# EAGLE design untitled (EAGLE 6.1)
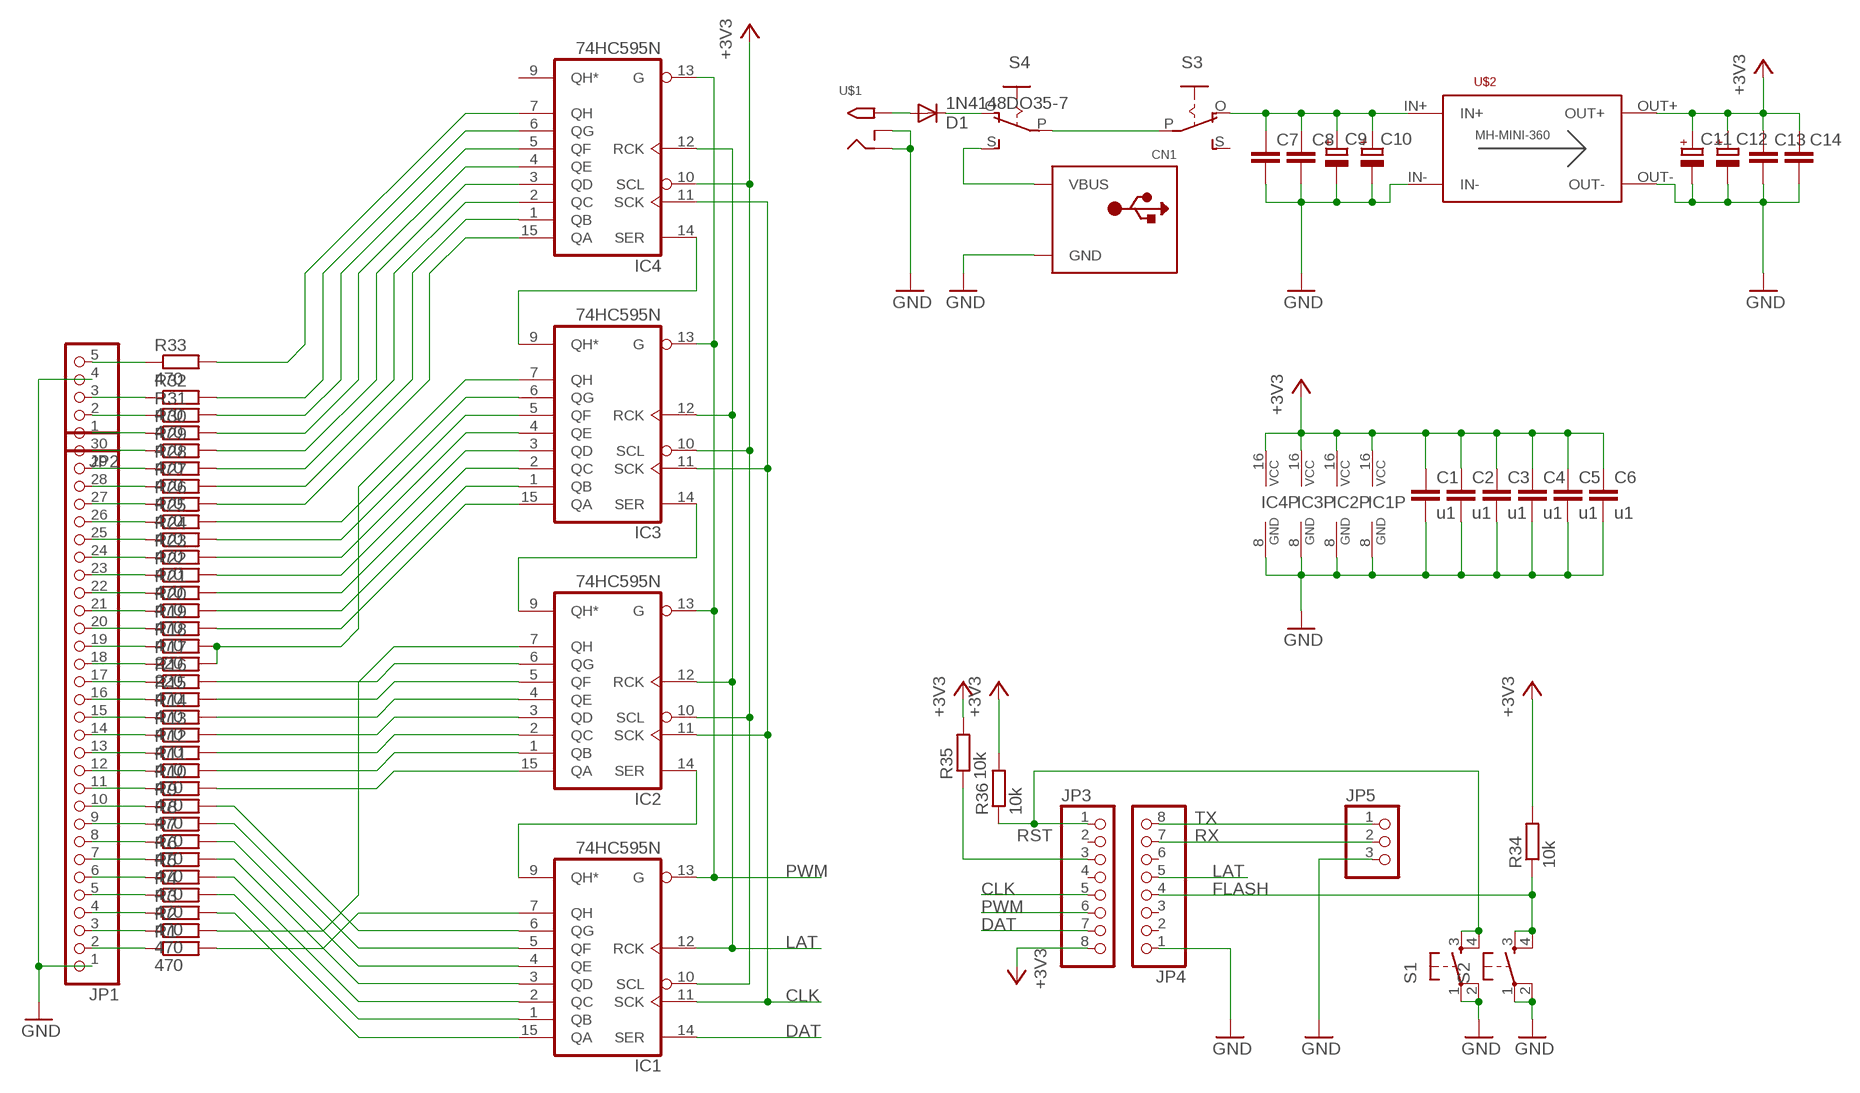
[diagram p0: schematic, sheet 1]

## Parts
C1  u1  C-EU025-025X050  [C025-025X050]
C2  u1  C-EU025-025X050  [C025-025X050]
C3  u1  C-EU025-025X050  [C025-025X050]
C4  u1  C-EU025-025X050  [C025-025X050]
C5  u1  C-EU025-025X050  [C025-025X050]
C6  u1  C-EU025-025X050  [C025-025X050]
C7  C-EU025-025X050  [C025-025X050]
C8  C-EU025-025X050  [C025-025X050]
C9  CPOL-EUE2.5-7  [E2,5-7]
C10  CPOL-EUE2.5-7  [E2,5-7]
C11  CPOL-EUE2.5-7  [E2,5-7]
C12  CPOL-EUE2.5-7  [E2,5-7]
C13  C-EU025-025X050  [C025-025X050]
C14  C-EU025-025X050  [C025-025X050]
CN1  USBPWR-ONLY  [USB-MINIB-THM]
D1  1N4148DO35-7  [DO35-7]
IC1  74HC595N  [DIL16]
IC2  74HC595N  [DIL16]
IC3  74HC595N  [DIL16]
IC4  74HC595N  [DIL16]
JP1  PINHD-1X30  [1X30]
JP2  PINHD-1X5  [1X05]
JP3  PINHD-1X8  [1X08]
JP4  PINHD-1X8  [1X08]
JP5  PINHD-1X3  [1X03]
R1  470  R-EU_0204/5  [0204/5]
R2  470  R-EU_0204/5  [0204/5]
R3  470  R-EU_0204/5  [0204/5]
R4  470  R-EU_0204/5  [0204/5]
R5  470  R-EU_0204/5  [0204/5]
R6  470  R-EU_0204/5  [0204/5]
R7  470  R-EU_0204/5  [0204/5]
R8  470  R-EU_0204/5  [0204/5]
R9  470  R-EU_0204/5  [0204/5]
R10  470  R-EU_0204/5  [0204/5]
R11  470  R-EU_0204/5  [0204/5]
R12  470  R-EU_0204/5  [0204/5]
R13  470  R-EU_0204/5  [0204/5]
R14  470  R-EU_0204/5  [0204/5]
R15  470  R-EU_0204/5  [0204/5]
R16  470  R-EU_0204/5  [0204/5]
R17  220  R-EU_0204/5  [0204/5]
R18  220  R-EU_0204/5  [0204/5]
R19  470  R-EU_0204/5  [0204/5]
R20  470  R-EU_0204/5  [0204/5]
R21  470  R-EU_0204/5  [0204/5]
R22  470  R-EU_0204/5  [0204/5]
R23  470  R-EU_0204/5  [0204/5]
R24  470  R-EU_0204/5  [0204/5]
R25  470  R-EU_0204/5  [0204/5]
R26  470  R-EU_0204/5  [0204/5]
R27  470  R-EU_0204/5  [0204/5]
R28  470  R-EU_0204/5  [0204/5]
R29  470  R-EU_0204/5  [0204/5]
R30  470  R-EU_0204/5  [0204/5]
R31  470  R-EU_0204/5  [0204/5]
R32  470  R-EU_0204/5  [0204/5]
R33  470  R-EU_0204/5  [0204/5]
R34  10k  R-EU_0204/7  [0204/7]
R35  10k  R-EU_0207/10  [0207/10]
R36  10k  R-EU_0207/10  [0207/10]
S1  TAC_SWITCHPTH  [TACTILE-PTH]
S2  TAC_SWITCHPTH  [TACTILE-PTH]
S3  EG1218S  [EG1218]
S4  EG1218S  [EG1218]
U$1  2.1MMJACKTHM  [PJ-102A]
U$2  DC-DC_CONV_MINISTD  [DC-DC_CONV_MINI]

## Nets
+3V3: C1.1 C2.1 C3.1 C4.1 C5.1 C6.1 C11.+ C12.+ C13.1 C14.1 IC1.10(SCL) IC1.16(VCC) IC2.10(SCL) IC2.16(VCC) IC3.10(SCL) IC3.16(VCC) IC4.10(SCL) IC4.16(VCC) JP3.8 R34.2 R35.2 R36.2 U$2.OUT+
CLK: IC1.11(SCK) IC2.11(SCK) IC3.11(SCK) IC4.11(SCK) JP3.5
DAT: IC1.14(SER) JP3.7
FLASH: JP4.4 R34.1 S2.3 S2.4
GND: C1.2 C2.2 C3.2 C4.2 C5.2 C6.2 C7.2 C8.2 C9.- C10.- C11.- C12.- C13.2 C14.2 CN1.GND CN1.GND1(GND) CN1.GND2(GND) CN1.GND3(GND) CN1.GND4(GND) IC1.8(GND) IC2.8(GND) IC3.8(GND) IC4.8(GND) JP1.1 JP2.4 JP4.1 JP5.3 S1.1 S1.2 S2.1 S2.2 U$1.RING U$1.RING_SW U$2.IN- U$2.OUT-
LAT: IC1.12(RCK) IC2.12(RCK) IC3.12(RCK) IC4.12(RCK) JP4.5
N$1: JP1.3 R2.1
N$2: JP1.2 R1.1
N$3: JP1.4 R3.1
N$4: JP1.5 R4.1
N$5: JP1.6 R5.1
N$6: JP1.7 R6.1
N$7: JP1.8 R7.1
N$8: JP1.9 R8.1
N$9: JP1.10 R9.1
N$10: JP1.11 R10.1
N$11: JP1.12 R11.1
N$12: JP1.13 R12.1
N$13: JP1.14 R13.1
N$14: JP1.15 R14.1
N$15: JP1.16 R15.1
N$16: JP1.17 R16.1
N$17: JP1.18 R17.1
N$18: JP1.19 R18.1
N$19: JP1.20 R19.1
N$20: JP1.21 R20.1
N$21: JP1.22 R21.1
N$22: JP1.23 R22.1
N$23: JP1.24 R23.1
N$24: JP1.25 R24.1
N$25: JP1.26 R25.1
N$26: JP1.27 R26.1
N$27: JP1.28 R27.1
N$28: JP1.29 R28.1
N$29: IC4.15(QA) R26.2
N$30: IC1.9(QH*) IC2.14(SER)
N$31: IC2.9(QH*) IC3.14(SER)
N$32: IC3.9(QH*) IC4.14(SER)
N$33: IC1.7(QH) R1.2
N$34: IC1.15(QA) R3.2
N$35: IC1.1(QB) R4.2
N$36: IC1.2(QC) R5.2
N$37: IC1.3(QD) R6.2
N$38: IC1.4(QE) R7.2
N$39: IC1.5(QF) R8.2
N$40: IC1.6(QG) R9.2
N$41: IC2.7(QH) R2.2
N$42: IC2.15(QA) R10.2
N$43: IC2.1(QB) R11.2
N$44: IC2.2(QC) R12.2
N$45: IC2.3(QD) R13.2
N$46: IC2.4(QE) R14.2
N$47: IC2.5(QF) R15.2
N$48: IC2.6(QG) R16.2
N$49: IC4.1(QB) R27.2
N$50: IC3.15(QA) R19.2
N$51: IC3.1(QB) R20.2
N$52: IC3.2(QC) R21.2
N$53: IC3.3(QD) R22.2
N$54: IC3.4(QE) R23.2
N$55: IC3.5(QF) R24.2
N$56: IC3.6(QG) R25.2
N$57: JP1.30 R29.1
N$58: JP2.1 R30.1
N$59: JP2.2 R31.1
N$60: JP2.3 R32.1
N$61: JP2.5 R33.1
N$62: IC3.7(QH) R17.2 R18.2
N$63: IC4.2(QC) R28.2
N$64: IC4.3(QD) R29.2
N$65: IC4.4(QE) R30.2
N$66: IC4.5(QF) R31.2
N$67: IC4.6(QG) R32.2
N$68: IC4.7(QH) R33.2
N$69: JP3.3 R35.1
N$70: D1.A U$1.TIP
N$72: C7.1 C8.1 C9.+ C10.+ S3.O U$2.IN+
N$73: S3.P S4.P
N$74: CN1.VBUS S4.S
N$75: D1.C S4.O
PWM: IC1.13(G) IC2.13(G) IC3.13(G) IC4.13(G) JP3.6
RST: JP3.1 R36.1 S1.3 S1.4
RX: JP4.7 JP5.2
TX: JP4.8 JP5.1
Unconnected: IC4.9(QH*) JP3.2 JP3.4 JP4.2 JP4.3 JP4.6 S3.S

## Library data of the parts
C1-C8 C13 C14 = rcl:C-EU: CAPACITOR, European symbol
C9-C12 = rcl:CPOL-EU: POLARIZED CAPACITOR, European symbol
CN1 = _MY_OWN_LIB:USB: USB Connectors USBMINIB - Surface Mount Female Mini-B USB Connector 4UConnector: 06564 By microbuilder.eu Thru-hole RA Female Mini-B USB Connector 4UConnector: 18732 By ladyada.net
D1 = diode:1N4148: DIODE high speed (Philips)
IC1-IC4 = 74xx-eu:74*595: 8-bit SHIFT REGISTER, output latch
JP1 = pinhead:PINHD-1X30: PIN HEADER
JP2 = pinhead:PINHD-1X5: PIN HEADER
JP3 JP4 = pinhead:PINHD-1X8: PIN HEADER
JP5 = pinhead:PINHD-1X3: PIN HEADER
R1-R36 = rcl:R-EU_: RESISTOR, European symbol
S1 S2 = SparkFun-Electromechanical:TAC_SWITCH: Momentary Switch Button commonly used for reset or general input. Spark Fun Electronics SKU : COM-00097 SMT- SWCH-08247
S3 S4 = _MY_OWN_LIB:EG1218: SLIDING SWITCH 0.1" spacing through hole, vertical SPDT slide switch http://www.ladyada.net/library/pcb/eaglelibrary.html
U$1 = adafruit:2.1MMJACK: 2.1mm x 5.5mm THM DC jack with internal switch. Digikey part #PJ-102A, 4UCON part #05537 2.1mm x 5.5mm SMT DC jack with internal switch. Digikey part #PJ-002A-SMT, 4UCON part #03267 By microbuilder.eu & adafruit.com
U$2 = _MY_OWN_LIB:DC-DC_CONV_MINI

## Board
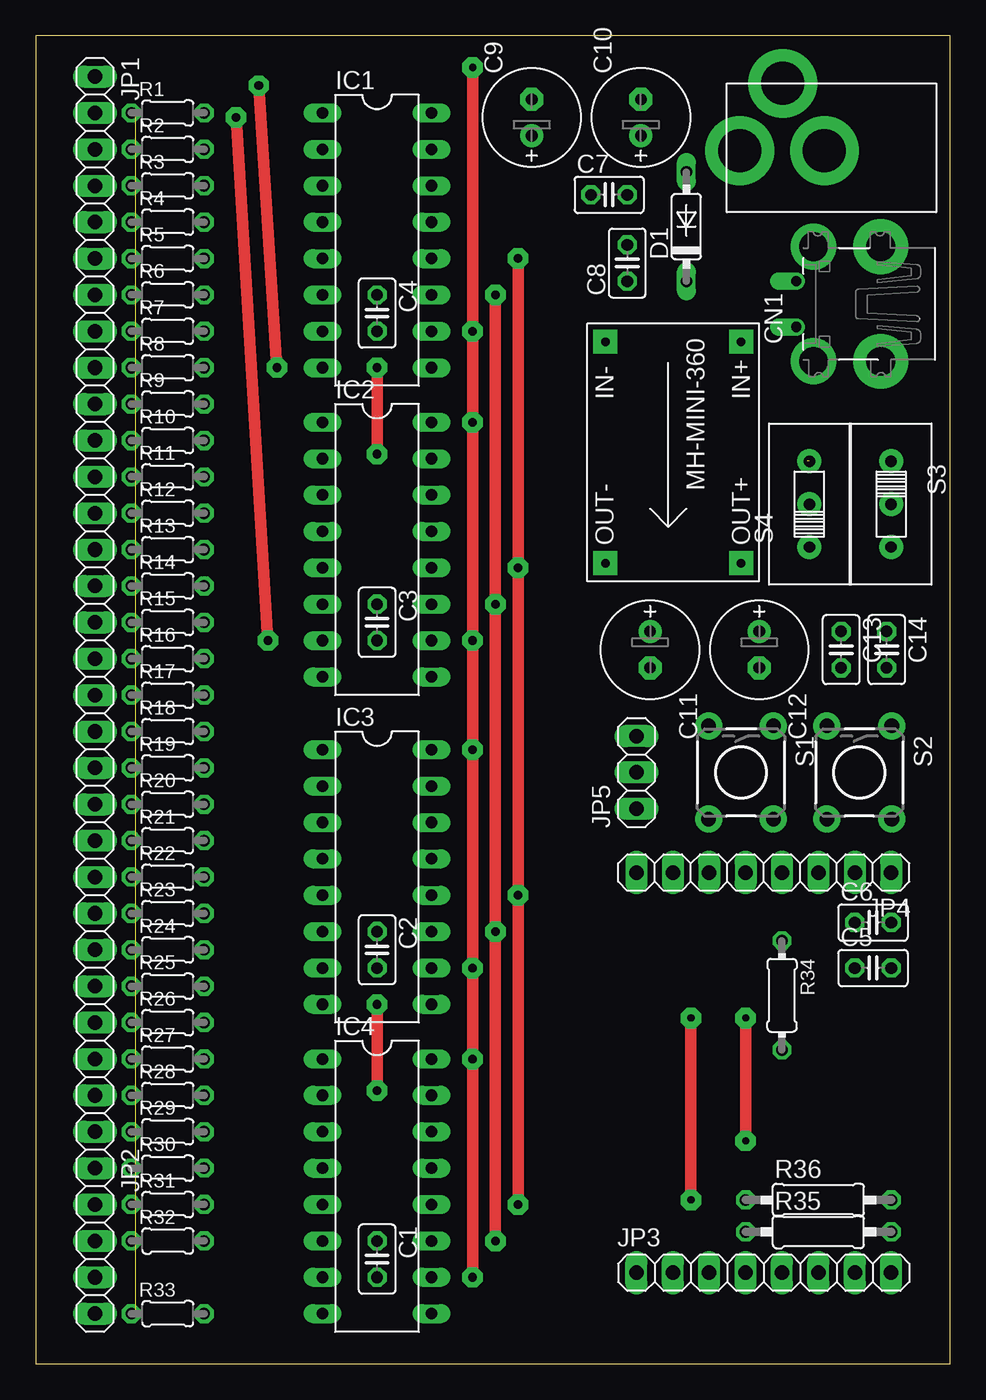
[diagram p1: board, top side]
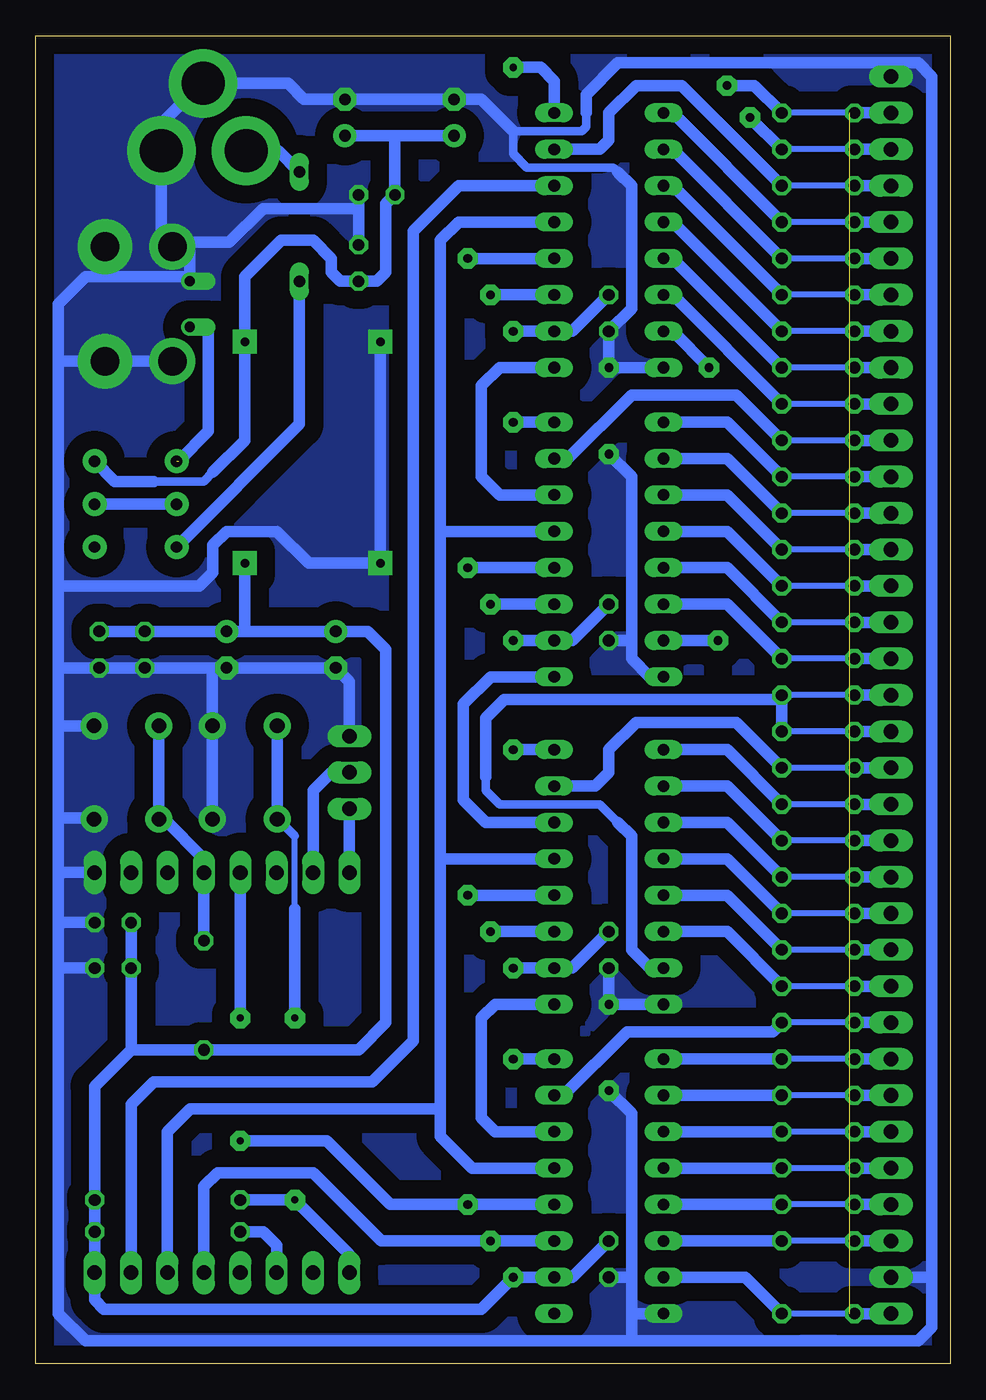
[diagram p2: board, bottom side, seen from below]

Size 63.8 x 92.7 mm. Coordinates in mm from the lower left corner, seen from the top.
Outline: 0,0 63.8,0 63.8,92.7 0,92.7 0,0
Copper layers (1*16): Top 0.035mm / dielectric 1.5mm / Bottom 0.035mm
Design rules: minimum track width 10mil, minimum drill 24mil, track to track 12mil, track to pad 12mil, pad to pad 12mil, via to via 12mil, smd to smd 10mil, copper to edge 12mil, drill to drill 12mil, minimum pad ring 10mil, minimum via ring 10mil, stop-mask expansion 4mil, vias tented up to drill 0mil, thermal gap 12mil

### Footprints (pad centres in the part's own frame; a part is rotated, then mirrored left to right if it is on the bottom)
C025-025X050 = drill 0.813 octagon: 1 -1.27,0; 2 1.27,0
E2,5-7 = drill 0.813 pad 1.6: + -1.27,0 | drill 0.813 pad 1.6 octagon: - 1.27,0
USB-MINIB-THM = drill 0.7 offset: GND 1.6,9.8; VBUS -1.6,9.8 | drill 2 pad 3.81: GND1 -4,3.9; GND4 4,3.9 | drill 2 pad 3.2: GND2 -4,8.6; GND3 4,8.6
DO35-7 = drill 0.813 long: A 3.81,0; C -3.81,0
DIL16 = drill 0.813 long: 1 -8.89,-3.81; 2 -6.35,-3.81; 3 -3.81,-3.81; 4 -1.27,-3.81; 5 1.27,-3.81; 6 3.81,-3.81; 7 6.35,-3.81; 8 8.89,-3.81; 9 8.89,3.81; 10 6.35,3.81; 11 3.81,3.81; 12 1.27,3.81; 13 -1.27,3.81; 14 -3.81,3.81; 15 -6.35,3.81; 16 -8.89,3.81
1X30 = drill 1.016 long: 1 -36.83,0; 2 -34.29,0; 3 -31.75,0; 4 -29.21,0; 5 -26.67,0; 6 -24.13,0; 7 -21.59,0; 8 -19.05,0; 9 -16.51,0; 10 -13.97,0; 11 -11.43,0; 12 -8.89,0; 13 -6.35,0; 14 -3.81,0; 15 -1.27,0; 16 1.27,0; 17 3.81,0; 18 6.35,0; 19 8.89,0; 20 11.43,0; 21 13.97,0; 22 16.51,0; 23 19.05,0; 24 21.59,0; 25 24.13,0; 26 26.67,0; 27 29.21,0; 28 31.75,0; 29 34.29,0; 30 36.83,0
1X05 = drill 1.016 long: 1 -5.08,0; 2 -2.54,0; 3 0,0; 4 2.54,0; 5 5.08,0
1X08 = drill 1.016 long: 1 -8.89,0; 2 -6.35,0; 3 -3.81,0; 4 -1.27,0; 5 1.27,0; 6 3.81,0; 7 6.35,0; 8 8.89,0
1X03 = drill 1.016 long: 1 -2.54,0; 2 0,0; 3 2.54,0
0204/5 = drill 0.813 octagon: 1 -2.54,0; 2 2.54,0
0204/7 = drill 0.813 octagon: 1 -3.81,0; 2 3.81,0
0207/10 = drill 0.813 octagon: 1 -5.08,0; 2 5.08,0
TACTILE-PTH = drill 1.016 pad 1.88: 1 -3.251,2.261; 2 3.251,2.261; 3 -3.251,-2.261; 4 3.251,-2.261
EG1218 = drill 0.8 pad 1.676: O -3,0; P 0,0; S 3,0
PJ-102A = drill 3 pad 4.8: RING 0.1,-3.39; RING_SW -4.6,-6.29; TIP 0.1,-9.29
DC-DC_CONV_MINI = drill 0.6 pad 1.676 square: IN+ 16.73,1.27; IN- 16.73,10.73; OUT+ 1.27,1.27; OUT- 1.27,10.73

### Placement (x,y rotation side)
C1  23.81,7.3 270 top
C2  23.81,28.89 270 top
C3  23.81,51.75 270 top
C4  23.81,73.34 270 top
C5  58.42,27.62 0 top
C6  58.42,30.8 0 top
C7  40.01,81.6 0 top
C8  41.27,76.83 90 top
C9  34.61,87 90 top
C10  42.23,87 90 top
C11  42.86,49.85 270 top
C12  50.48,49.85 270 top
C13  56.2,49.85 270 top
C14  59.37,49.85 270 top
CN1  62.87,73.98 90 top
D1  45.4,79.38 90 top
IC1  23.81,78.42 270 top
IC2  23.81,56.83 270 top
IC3  23.81,33.97 270 top
IC4  23.81,12.38 270 top
JP1  4.13,53.02 270 top
JP2  4.13,8.57 270 top
JP3  50.8,6.35 0 top
JP4  50.8,34.29 180 top
JP5  41.91,41.27 90 top
R1  9.21,87.31 0 top
R2  9.21,84.77 0 top
R3  9.21,82.23 0 top
R4  9.21,79.69 0 top
R5  9.21,77.15 0 top
R6  9.21,74.61 0 top
R7  9.21,72.07 0 top
R8  9.21,69.53 0 top
R9  9.21,66.99 0 top
R10  9.21,64.45 0 top
R11  9.21,61.91 0 top
R12  9.21,59.37 0 top
R13  9.21,56.83 0 top
R14  9.21,54.29 0 top
R15  9.21,51.75 0 top
R16  9.21,49.21 0 top
R17  9.21,46.67 0 top
R18  9.21,44.13 0 top
R19  9.21,41.59 0 top
R20  9.21,39.05 0 top
R21  9.21,36.51 0 top
R22  9.21,33.97 0 top
R23  9.21,31.43 0 top
R24  9.21,28.89 0 top
R25  9.21,26.35 0 top
R26  9.21,23.81 0 top
R27  9.21,21.27 0 top
R28  9.21,18.73 0 top
R29  9.21,16.19 0 top
R30  9.21,13.65 0 top
R31  9.21,11.11 0 top
R32  9.21,8.57 0 top
R33  9.21,3.49 0 top
R34  52.07,25.72 270 top
R35  54.61,9.21 0 top
R36  54.61,11.43 0 top
S1  49.21,41.27 270 top
S2  57.47,41.27 270 top
S3  59.69,60.01 270 top
S4  53.98,60.01 90 top
U$1  58.42,84.77 270 top
U$2  50.48,54.61 90 top

### Tracks (layer width: path | path; a pad name or v marks a point on that pad's centre or on a via)
+3V3  (via drill 0.5 pad 1.42, 0.6 pad 1.42)
  Top 0.813: v30.48,6.03 v30.48,21.27 v30.48,27.62 v30.48,42.86 v30.48,50.48 v30.48,65.72 v30.48,72.07 v30.48,90.49
  Bottom 0.813: C4.1 26.35,72.07 IC1.10 v30.48,72.07 | C3.1 26.35,50.48 IC2.10 v30.48,50.48 | C2.1 26.35,27.62 IC3.10 v30.48,27.62 | C1.1 26.35,6.03 IC4.10 v30.48,6.03 32.7,3.81 59.05,3.81 59.69,4.45 JP3.8 R35.2 R36.2 59.69,19.37 57.15,21.91 | IC4.16 v30.48,21.27 | IC3.16 v30.48,42.86 | IC2.16 v30.48,65.72 | v30.48,90.49 28.57,90.49 27.62,89.53 IC1.16 | 49.21,51.12 C11.+ 40.64,51.12 39.37,49.85 39.37,23.81 41.27,21.91 R34.2 57.15,21.91 | 49.21,51.12 C12.+ C13.1 C14.1 | C6.1 C5.1 57.15,21.91 | U$2.OUT+ 49.21,51.12
CLK  (via drill 0.6 pad 1.42)
  Top 0.813: v32.07,8.57 v32.07,30.16 v32.07,53.02 v32.07,74.61
  Bottom 0.813: IC4.11 v32.07,8.57 39.69,8.57 44.45,13.34 51.12,13.34 52.07,12.38 JP3.5 | v32.07,74.61 IC1.11 | IC3.11 v32.07,30.16 | IC2.11 v32.07,53.02
DAT
  Bottom 0.813: IC1.14 34.29,82.23 37.47,79.06 37.47,22.54 40.32,19.68 55.56,19.68 57.15,18.1 JP3.7
FLASH
  Bottom 0.813: R34.1 JP4.4 52.07,35.24 54.85,38.02 S2.4 S2.3
GND  (via drill 0.6 pad 1.42)
  Top 0.813: v23.81,19.05 v23.81,25.08 | v23.81,69.53 v23.81,63.5
  Bottom 0.61: 23.18,83.19 23.5,83.5 29.53,83.5 30.48,84.45 30.48,86.04 25.72,86.04 25.4,86.36 25.4,87.31
  Bottom 0.813: 1.27,6.03 1.27,2.54 2.22,1.59 22.23,1.59 | 1.27,6.03 JP2.4 | 1.27,6.03 1.27,89.85 2.22,90.81 4.13,90.81 | IC3.8 v23.81,25.08 C2.2 | 22.23,6.03 22.23,17.46 v23.81,19.05 | C1.2 22.23,6.03 | 22.23,50.48 22.23,49.21 20.95,47.94 IC2.8 | 22.23,50.48 22.23,61.91 v23.81,63.5 | IC1.8 v23.81,69.53 C4.2 22.23,73.66 22.23,82.23 23.18,83.19 | 25.4,87.31 25.4,88.58 23.18,90.81 4.13,90.81 | JP1.1 4.13,90.81 | C3.2 22.23,50.48 | 22.23,6.03 22.23,3.49 | 22.23,3.49 22.23,1.59 | IC4.8 22.23,3.49 | 22.23,1.59 60.33,1.59 62.23,3.49 62.23,27.62 | 62.23,27.62 62.23,30.8 | 62.23,30.8 62.23,34.29 | 62.23,34.29 62.23,38.1 | JP4.1 62.23,34.29 | S2.2 59.8,38.1 62.23,38.1 | 62.23,38.1 62.23,44.45 | 62.23,44.45 62.23,48.58 | S2.1 62.15,44.53 62.23,44.45 | 62.23,48.58 C14.2 C13.2 51.44,48.58 | JP5.3 41.91,47.62 C11.- C12.- 51.44,48.58 | 51.44,48.58 51.47,48.54 S1.1 S1.2 | C6.2 62.23,30.8 | C5.2 62.23,27.62 | U$2.IN- U$2.OUT- 44.77,55.88 46.99,58.1 50.48,58.1 51.44,57.15 51.44,55.24 52.39,54.29 62.23,54.29 | 53.02,78.3 50.29,78.3 47.94,80.64 41.27,80.64 | 53.02,78.3 54.1,78.3 54.29,78.11 | CN1.GND 53.06,78.25 53.02,78.3 | CN1.GND3 54.27,78.39 55.03,79.16 U$1.RING 55.03,86.58 52.23,89.37 U$1.RING_SW 46.19,89.37 45.09,88.27 C10.- C9.- 32.7,88.27 30.48,86.04 | 62.23,48.58 62.23,54.29 | 62.23,54.29 62.23,69.85 | 62.23,69.85 62.23,73.98 60.33,75.88 59.05,75.88 | 59.05,75.88 53.02,75.88 | CN1.GND2 62.1,69.98 62.23,69.85 | CN1.GND4 58.97,75.97 59.05,75.88 | C7.2 41.27,80.64 | 41.27,80.64 C8.2
  pour Bottom (isolate 1.27, no thermals): 0,92.39 63.82,92.39 63.82,0 0,0
LAT  (via drill 0.5 pad 1.42, 0.6 pad 1.42)
  Top 0.813: v33.66,11.11 v33.66,32.7 v33.66,55.56 v33.66,77.15 | v49.53,15.56 v49.53,24.13
  Bottom 0.813: IC4.12 v33.66,11.11 39.05,11.11 43.5,15.56 v49.53,15.56 | v33.66,77.15 IC1.12 | IC3.12 v33.66,32.7 | IC2.12 v33.66,55.56 | v49.53,24.13 JP4.5
N$1
  Bottom 0.813: JP1.3 R2.1
N$2
  Bottom 0.813: R1.1 JP1.2
N$3
  Bottom 0.813: R3.1 JP1.4
N$4
  Bottom 0.813: JP1.5 R4.1
N$5
  Bottom 0.813: R5.1 JP1.6
N$6
  Bottom 0.813: R6.1 JP1.7
N$7
  Bottom 0.813: JP1.8 R7.1
N$8
  Bottom 0.813: R8.1 JP1.9
N$9
  Bottom 0.813: JP1.10 R9.1
N$10
  Bottom 0.813: R10.1 JP1.11
N$11
  Bottom 0.813: JP1.12 R11.1
N$12
  Bottom 0.813: R12.1 JP1.13
N$13
  Bottom 0.813: JP1.14 R13.1
N$14
  Bottom 0.813: R14.1 JP1.15
N$15
  Bottom 0.813: JP1.16 R15.1
N$16
  Bottom 0.813: R16.1 JP1.17
N$17
  Bottom 0.813: JP1.18 R17.1
N$18
  Bottom 0.813: R18.1 JP1.19
N$19
  Bottom 0.813: JP1.20 R19.1
N$20
  Bottom 0.813: R20.1 JP1.21
N$21
  Bottom 0.813: JP1.22 R21.1
N$22
  Bottom 0.813: R22.1 JP1.23
N$23
  Bottom 0.813: JP1.24 R23.1
N$24
  Bottom 0.813: R24.1 JP1.25
N$25
  Bottom 0.813: JP1.26 R25.1
N$26
  Bottom 0.813: R26.1 JP1.27
N$27
  Bottom 0.813: JP1.28 R27.1
N$28
  Bottom 0.813: R28.1 JP1.29
N$29
  Bottom 0.813: R26.2 12.38,23.18 22.54,23.18 26.99,18.73 IC4.15
N$30
  Bottom 0.813: IC2.14 31.43,60.64 32.7,61.91 32.7,68.26 31.43,69.53 IC1.9
N$31
  Bottom 0.813: IC3.14 32.38,37.78 33.97,39.37 33.97,46.04 32.07,47.94 IC2.9
N$32
  Bottom 0.813: IC3.9 31.75,25.08 32.7,24.13 32.7,17.14 31.75,16.19 IC4.14
N$33  (via drill 0.6 pad 1.42)
  Top 0.813: v15.56,89.22 v16.83,69.53
  Bottom 0.813: R1.2 13.65,89.22 v15.56,89.22 | v16.83,69.53 19.37,72.07 IC1.7
N$34
  Bottom 0.813: R3.2 18.73,89.22 21.91,89.22 23.81,87.31 23.81,85.41 24.45,84.77 IC1.15
N$35
  Bottom 0.813: R4.2 19.37,87.31 IC1.1
N$36
  Bottom 0.813: R5.2 19.37,84.77 IC1.2
N$37
  Bottom 0.813: R6.2 19.37,82.23 IC1.3
N$38
  Bottom 0.813: R7.2 19.37,79.69 IC1.4
N$39
  Bottom 0.813: R8.2 19.37,77.15 IC1.5
N$40
  Bottom 0.813: R9.2 19.37,74.61 IC1.6
N$41  (via drill 0.6 pad 1.42)
  Top 0.813: v13.97,87 v16.19,50.48
  Bottom 0.813: R2.2 v13.97,87 | v16.19,50.48 IC2.7
N$42
  Bottom 0.813: R10.2 14.92,67.63 22.23,67.63 26.67,63.18 IC2.15
N$43
  Bottom 0.813: R11.2 15.56,65.72 IC2.1
N$44
  Bottom 0.813: R12.2 15.56,63.18 IC2.2
N$45
  Bottom 0.813: R13.2 15.56,60.64 IC2.3
N$46
  Bottom 0.813: R14.2 15.56,58.1 IC2.4
N$47
  Bottom 0.813: R15.2 15.56,55.56 IC2.5
N$48
  Bottom 0.813: R16.2 15.56,53.02 IC2.6
N$49
  Bottom 0.813: R27.2 IC4.1
N$50
  Bottom 0.813: R19.2 14.92,44.77 21.91,44.77 23.81,42.86 23.81,41.27 24.77,40.32 IC3.15
N$51
  Bottom 0.813: R20.2 15.56,42.86 IC3.1
N$52
  Bottom 0.813: R21.2 15.56,40.32 IC3.2
N$53
  Bottom 0.813: R22.2 15.56,37.78 IC3.3
N$54
  Bottom 0.813: R23.2 15.56,35.24 IC3.4
N$55
  Bottom 0.813: R24.2 15.56,32.7 IC3.5
N$56
  Bottom 0.813: R25.2 15.56,30.16 IC3.6
N$57
  Bottom 0.813: R29.1 JP1.30
N$58
  Bottom 0.813: JP2.1 R30.1
N$59
  Bottom 0.813: JP2.2 R31.1
N$60
  Bottom 0.813: R32.1 JP2.3
N$61
  Bottom 0.813: JP2.5 R33.1
N$62
  Bottom 0.61: 23.18,37.78 24.45,39.05 31.43,39.05 32.38,40.01 32.38,40.96
  Bottom 0.813: 11.75,46.35 R17.2 | R18.2 11.75,46.35 | 11.75,46.35 31.11,46.35 32.38,45.09 32.38,40.96 | IC3.7 20.95,27.62 22.23,28.89 22.23,36.83 23.18,37.78
N$63
  Bottom 0.813: R28.2 IC4.2
N$64
  Bottom 0.813: R29.2 IC4.3
N$65
  Bottom 0.813: R30.2 IC4.4
N$66
  Bottom 0.813: R31.2 IC4.5
N$67
  Bottom 0.813: R32.2 IC4.6
N$68
  Bottom 0.813: R33.2 14.29,6.03 IC4.7
N$69
  Bottom 0.813: JP3.3 46.99,8.26 47.94,9.21 R35.1
N$70
  Bottom 0.813: U$1.TIP 46.89,84.67 D1.A
N$71  (32 unrouted)
  Bottom 0.406: 6.99,87.31 11.43,87.31 | 6.99,84.77 11.43,84.77 | 6.99,82.23 11.43,82.23 | 6.99,79.69 11.43,79.69 | 6.99,77.15 11.43,77.15 | 6.99,74.61 11.43,74.61 | 6.99,72.07 11.43,72.07 | 6.99,69.53 11.43,69.53 | 6.99,66.99 11.43,66.99 | 6.99,64.45 11.43,64.45 | 6.99,61.91 11.43,61.91 | 6.99,59.37 11.43,59.37 | 6.99,56.83 11.43,56.83 | 6.99,54.29 11.43,54.29 | 6.99,51.75 11.43,51.75 | 6.99,49.21 11.43,49.21 | 6.99,46.67 11.43,46.67 | 6.99,44.13 11.43,44.13 | 6.99,41.59 11.43,41.59 | 6.99,39.05 11.43,39.05 | 6.99,36.51 11.43,36.51 | 6.99,33.97 11.43,33.97 | 6.99,31.43 11.43,31.43 | 6.99,28.89 11.43,28.89 | 6.99,26.35 11.43,26.35 | 6.99,23.81 11.43,23.81 | 6.99,21.27 11.43,21.27 | 6.99,18.73 11.43,18.73 | 6.99,16.19 11.43,16.19 | 6.99,13.65 11.43,13.65 | 6.99,11.11 11.43,11.11 | 6.99,8.57 11.43,8.57 | 6.99,3.49 11.43,3.49
N$72
  Bottom 0.61: 51.44,62.23 52.07,61.59 55.56,61.59
  Bottom 0.813: S3.O 58.28,61.59 55.56,61.59 | 51.44,62.23 49.21,64.45 U$2.IN+ 49.21,75.88 46.67,78.42 44.45,78.42 43.18,77.15 43.18,76.2 42.55,75.56 C8.1 40.01,75.56 39.37,76.2 39.37,80.96 C7.1 38.73,85.72 | C9.+ 38.73,85.72 | 38.73,85.72 C10.+
N$73
  Bottom 0.813: S4.P S3.P
N$74  (1 unrouted)
  Bottom 0.813: CN1.VBUS 51.77,72.38 51.75,72.39 51.75,65.09 53.83,63.01
N$75
  Bottom 0.813: D1.C 45.4,65.58 S4.O
PWM
  Bottom 0.813: IC1.13 34.29,79.69 35.56,78.42 35.56,58.1 | IC2.13 35.56,58.1 | 35.56,58.1 35.56,35.24 | IC3.13 35.56,35.24 | JP3.6 54.61,16.19 53.02,17.78 35.56,17.78 | 35.56,17.78 35.56,15.88 33.34,13.65 IC4.13 | 35.56,17.78 35.56,35.24
RST  (via drill 0.5 pad 1.42)
  Top 0.813: v45.72,11.43 v45.72,24.13
  Bottom 0.406: 45.72,31.75 45.72,36.83
  Bottom 0.61: S1.4 46.91,38.02 45.72,36.83
  Bottom 0.813: JP3.1 41.91,7.62 v45.72,11.43 R36.1 | S1.3 S1.4 | v45.72,24.13 45.72,31.75
RX
  Bottom 0.813: JP4.7 44.45,40.01 43.18,41.27 JP5.2
TX
  Bottom 0.813: JP4.8 JP5.1